# Altium schematic sheet Harvester.SchDoc
size A4
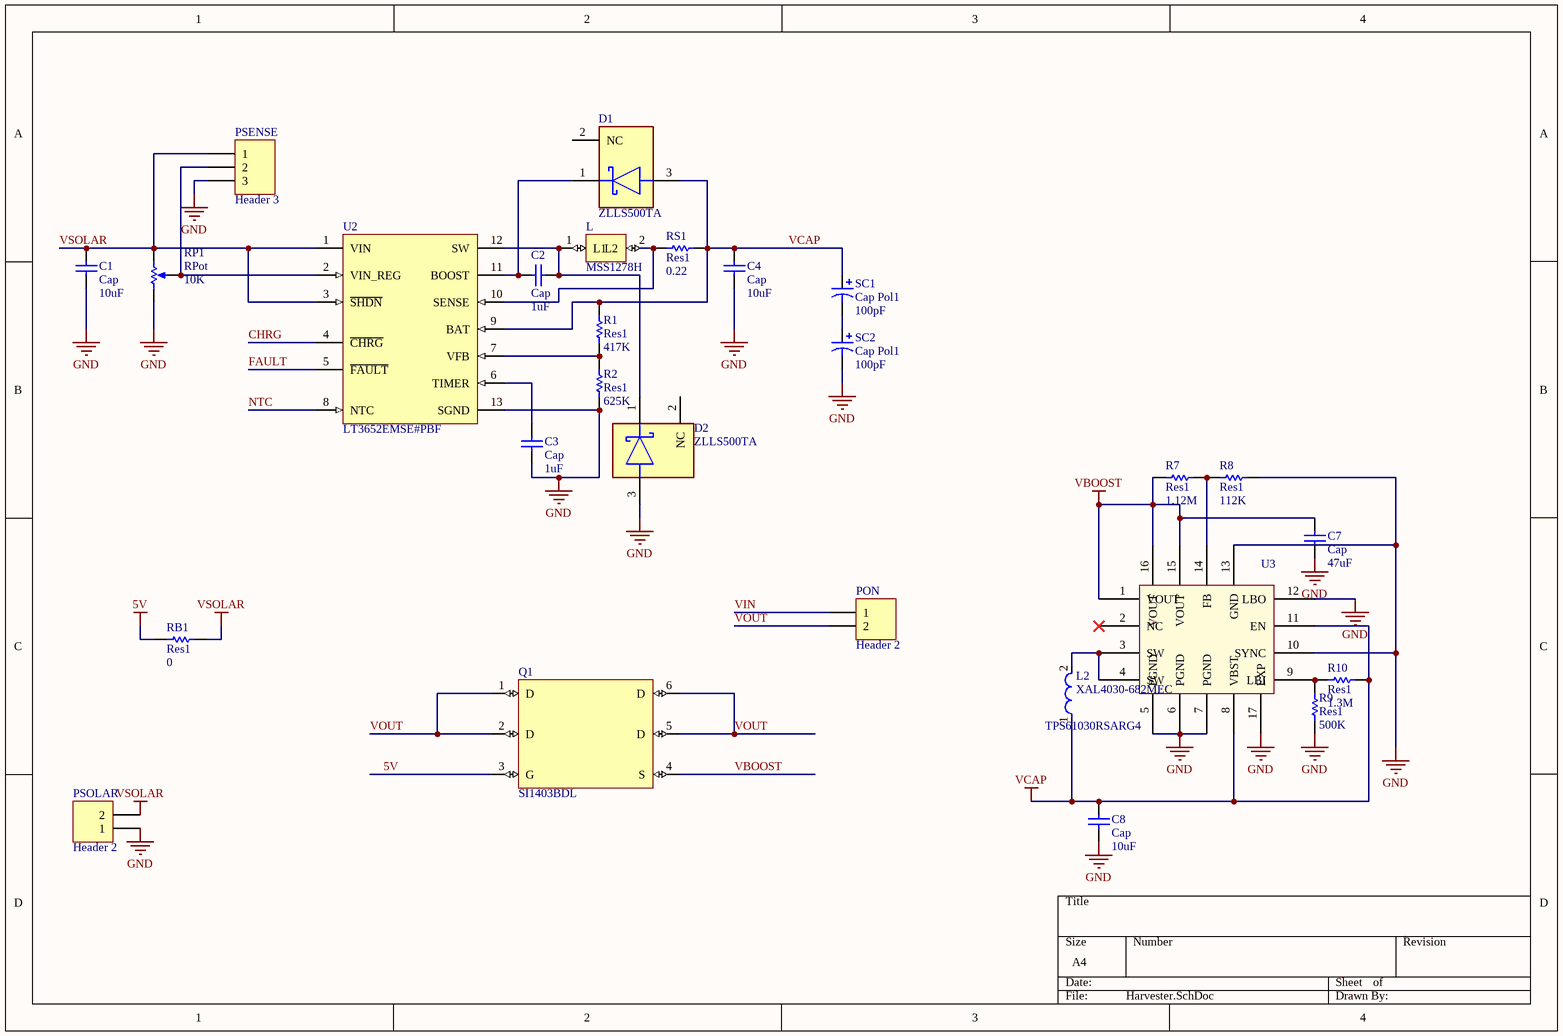
[diagram p0: Harvester.SchDoc]

## Parts
C1  Cap  value 10uF  [1812]
C2  Cap  value 1uF  [1812]
C3  Cap  value 1uF  [1812]
C4  Cap  value 10uF  [1812]
C7  Cap  value 47uF  [1812]
C8  Cap  value 10uF  [1608[0603]]
D1  ZLLS500TA  [FP-SOT23-IPC_B]
D2  ZLLS500TA  [FP-SOT23-IPC_B]
L  MSS1278H  [MSS1278H]
L2  XAL4030-682MEC  [FP-XAL4030-472MEC-MFG]
PON  Header 2  [HDR1X2]
PSENSE  Header 3  [HDR1X3]
PSOLAR  Header 2  [HDR1X2]
Q1  SI1403BDL  [SI1403BDL]
R1  Res1  value 417K  [0603R-GENERIC]
R2  Res1  value 625K  [0603R-GENERIC]
R7  Res1  value 1.12M  [0603R-GENERIC]
R8  Res1  value 112K  [0603R-GENERIC]
R9  Res1  value 500K  [0603R-GENERIC]
R10  Res1  value 1.3M  [0603R-GENERIC]
RB1  Res1  value 0  [0603R-GENERIC]
RP1  RPot  value 10K  [VR5]
RS1  Res1  value 0.22  [0603R-GENERIC]
SC1  Cap Pol1  value 100pF  [RB7.6-15]
SC2  Cap Pol1  value 100pF  [RB7.6-15]
U2  LT3652EMSE#PBF  [LT-MSE-12-EDP_M]
U3  TPS61030RSARG4  [QFN65P400X400X100-17N]

## Nets
5V: Q1.3(G) RB1.1
GND: C1.2 C3.2 C4.2 C7.1 C8.1 D2.3(A) PSENSE.3 PSOLAR.1 R2.2 R8.1 R9.2 RP1.1(TOP) SC2.2 U2.13(SGND) U3.5(PGND) U3.6(PGND) U3.7(PGND) U3.10(SYNC) U3.12(LBO) U3.13(GND) U3.17(EXP)
VBOOST: C7.2 Q1.4(S) R7.2 U3.1(VOUT) U3.15(VOUT) U3.16(VOUT)
VCAP: C4.1 C8.2 D1.3(A) L2.1 R1.1 R10.2 RS1.2 SC1.1 U2.9(BAT) U3.8(VBST) U3.11(EN)
VSOLAR: C1.1 PSENSE.1 PSOLAR.2 RB1.2 RP1.2(BOT) U2.1(VIN) U2.3(~{SHDN})
CHRG: U2.4(~{CHRG})
FAULT: U2.5(~{FAULT})
NTC: U2.8(NTC)
VIN: PON.1
VOUT: PON.2 Q1.1(D) Q1.2(D) Q1.5(D) Q1.6(D)
NetC2_1: C2.1 D1.1(C) U2.11(BOOST)
NetC2_2: C2.2 D2.1(C) L.1(L1) U2.12(SW)
NetC3_1: C3.1 U2.6(TIMER)
NetL2_2: L2.2 U3.3(SW) U3.4(SW)
NetL_2: L.2(L2) RS1.1 U2.10(SENSE)
NetPSENSE_2: PSENSE.2 RP1.3(TAP) U2.2(VIN_REG)
NetR1_2: R1.2 R2.1 U2.7(VFB)
NetR7_1: R7.1 R8.2 U3.14(FB)
NetR9_1: R9.1 R10.1 U3.9(LBI)
NetSC1_2: SC1.2 SC2.1

Not connected (* = marked no-connect by the designer): D1 2(NC); D2 2(NC); U3 2(NC)*

## Library data of the parts
C1-C4 C7 C8 = Cap: Capacitor; Published: 8-Jun-2000; LatestRevisionDate: 17-Jul-2002; LatestRevisionNote: Re-released for DXP Platform.; PackageReference: RAD-0.3; Publisher: Altium Limited; PackageDescription: Radial Cap, Thru-Hole; 2 Leads; 0.3 in Pin Spacing
D1 D2 = CMP-12790-000060-1: DIODE SCHOTTKY 40V 700MA SOT23-3; Max Forward Surge Current (Ifsm): 3.2A; Polarity: Standard; Peak Reverse Current: 10uA; Forward Voltage: 800mV; Peak Non-Repetitive Surge Current: 13A; Capacitance: 16pF; Power Dissipation: 500mW; Element Configuration: Single; Reverse Recovery Time: 3ns; Max Reverse Voltage (DC): 40V; Min Operating Temperature: -55°C; Height: 1mm; Termination: SMD/SMT; Forward Current: 700mA; Current Rating: 700mA; Max Operating Temperature: 150°C; Case/Package: SOT-23; Output Current: 700mA; Lead Free: Lead Free; Radiation Hardening: No; Mount: Surface Mount; Weight: 0.000282oz; Package Quantity: 3000; Width: 1.4mm; Packaging: Tape and Reel; Length: 3.05mm; Average Rectified Current: 700mA; Number of Pins: 3; Max Repetitive Reverse Voltage (Vrrm): 40V; Voltage Rating (DC): 40V
L2 = CMP-11268-000082-1: Power Inductor (SMD), 6.8 µH, 5.1 A, Shielded, 4.5 A, XAL40xx Series, 4mm x 4mm x 3.1mm; Tolerance: 20%; DC Resistance (DCR): 44.1mR; Inductance: 4.7uH; Saturation Current: 4.5A; Max DC Current: 5.1A; Self Resonant Frequency: 36MHz; Test Frequency: 100kHz; Core Material: Composite; REACH SVHC: No SVHC; Height: 3.1mm; Package Quantity: 500; Width: 4.3mm; Mount: Surface Mount; RoHS Compliant: Yes; Case/Package: SMD/SMT; Length: 4.3mm; Packaging: Tape and Reel; Max Operating Temperature: 125°C; Min Operating Temperature: -40°C; Series: XAL4030; Termination: SMD/SMT; Inductance Tolerance: 20%; Shielding: Shielded; RMS Current (Irms): 5.1A; Lead Free: Contains Lead
PON PSOLAR = Header 2: Header, 2-Pin; LatestRevisionDate: 17-Jul-2002; LatestRevisionNote: Re-released for DXP Platform.; Publisher: Altium Limited
PSENSE = Header 3: Header, 3-Pin; LatestRevisionDate: 17-Jul-2002; LatestRevisionNote: Re-released for DXP Platform.; Publisher: Altium Limited
Q1 = SI1403BDL: RC (Pi) EMI Filter 2nd Order Low Pass 2 Channel R = 33Ohms, C = 47pF 6-TSSOP, SC-88, SOT-363; MP: USBUF01W6; MF: STMicroelectronics; Price: None; Availability: Unavailable; SnapEDA_Link: https://www.snapeda.com/parts/USBUF01W6/STMicroelectronics/view-part/274456/?ref=snap; Value: *; Package: SOT-363 STMicroelectronics
R1 R2 R7-R10 RB1 RS1 = Res1: Resistor; Published: 8-Jun-2000; LatestRevisionDate: 17-Jul-2002; LatestRevisionNote: Re-released for DXP Platform.; PackageReference: AXIAL-0.3; Publisher: Altium Limited; PackageDescription: Axial Device, Thru-Hole; 2 Leads; 0.3 in Pin Spacing
RP1 = RPot: Potentiometer; Sim Note: Enter the Resistance value and the set point into parameter fields.; Set Position: 0.5; Published: 8-Jun-2000; LatestRevisionDate: 17-Jul-2002; LatestRevisionNote: Re-released for DXP Platform.; PackageReference: VR5; Publisher: Altium Limited; PackageDescription: Variable Resistor, Thru-Hole; 3 Leads
SC1 SC2 = Cap Pol1: Polarized Capacitor (Radial); Published: 8-Jun-2000; LatestRevisionDate: 17-Jul-2002; LatestRevisionNote: Re-released for DXP Platform.; PackageReference: RB7.6-15; Publisher: Altium Limited; PackageDescription: Polarized Capacitor (Radial); 2 Leads
U2 = CMP-0473-00138-1: Power Tracking 2 A Battery Charger for Solar Power, 12-pin SOP (MSE-12-EDP), -40 to 125 degC, Pb-Free; Manufacturer: Linear Technology; Vin Max(V): 32; Number of Outputs: 1; Vin Min(V): 4.95; Topology: Battery Charger; ComponentLink1Description: Manufacturer URL; PartNumber: LT3652EMSE#PBF; ComponentLink2URL: http://cds.linear.com/docs/en/datasheet/3652fd.pdf; ComponentLink1URL: http://www.linear.com/; ComponentLink2Description: Datasheet; Mounting Technology: Surface Mount; Energy Source: Solar; DatasheetVersion: Rev. D; RoHS: TRUE; PackageDescription: 12-Pin Plastic MSOP, Exposed Die Pad, Body 4.039 x 3 mm, Pitch 0.65 mm; ComponentLink3URL: http://cds.linear.com/docs/en/packaging/05081666_G_MSE12.pdf; ComponentLink3Description: Package Specification; PackageVersion: Rev. G, 05/2013; PackageReference: MSE-12-EDP